# Altium project pdmlse_pcb.PrjPcb (part 2 of 4)

## Sheet LDOs.SchDoc: Power Delivery
size D; Author: Kunmo Kim; DrawnBy: Kunmo Kim; SheetNumber: 2; SheetTotal: 15
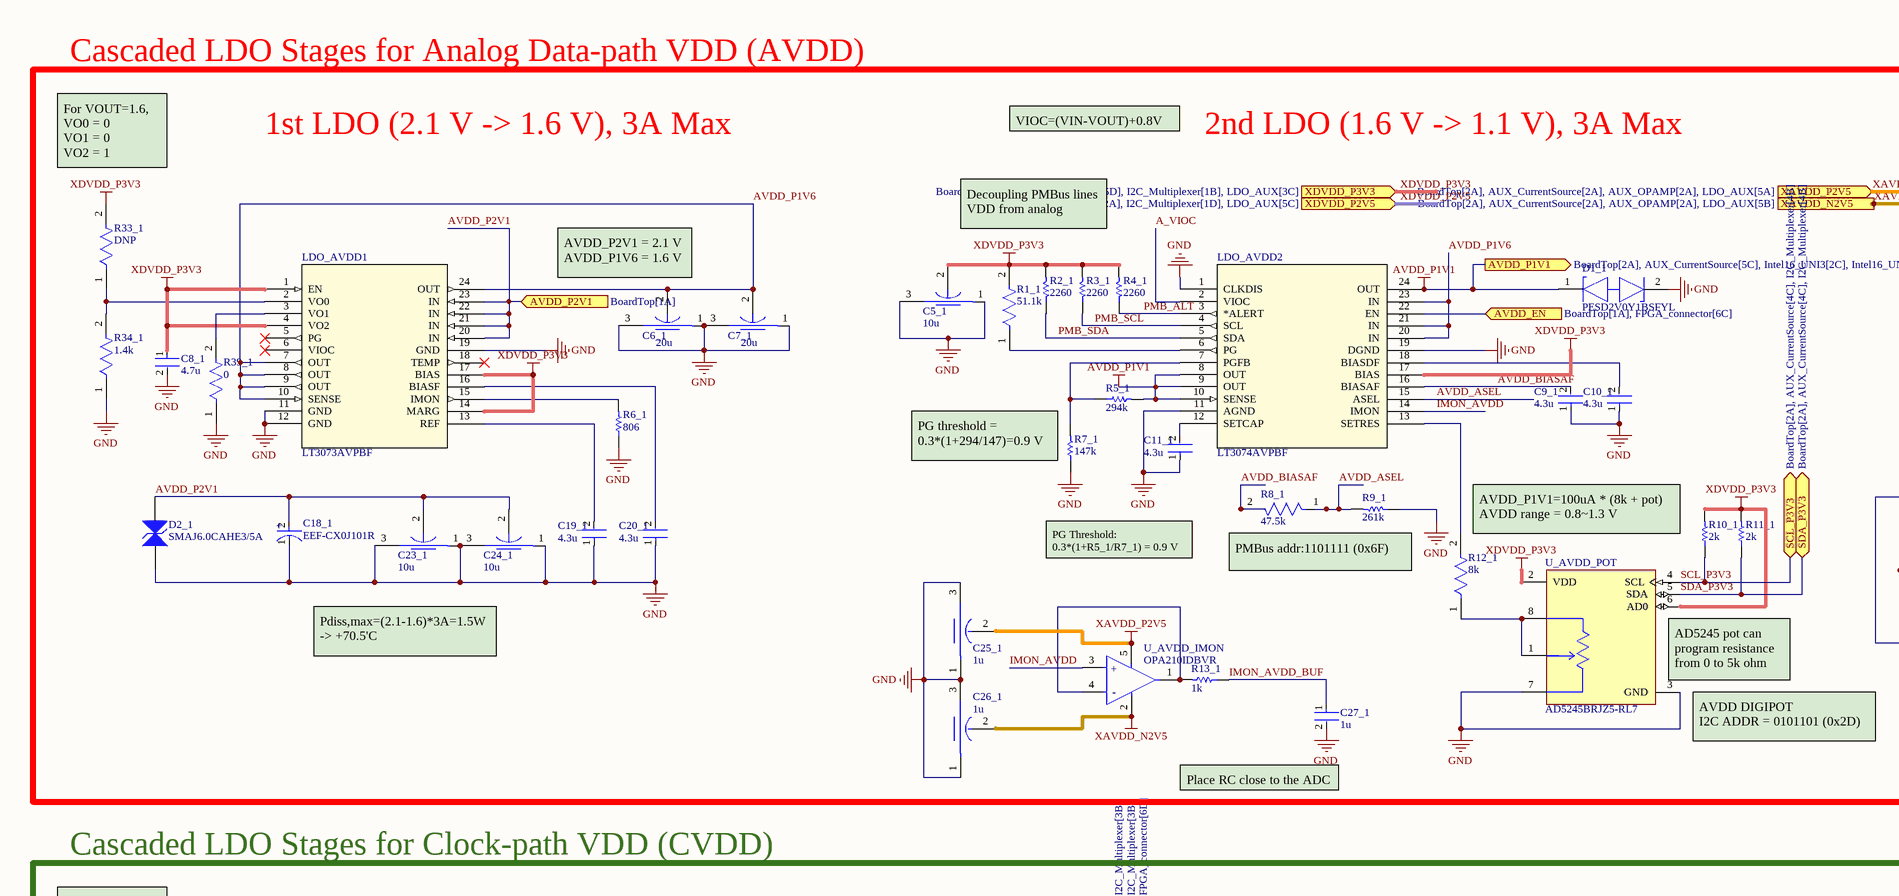
[diagram p1: LDOs.SchDoc, top left]
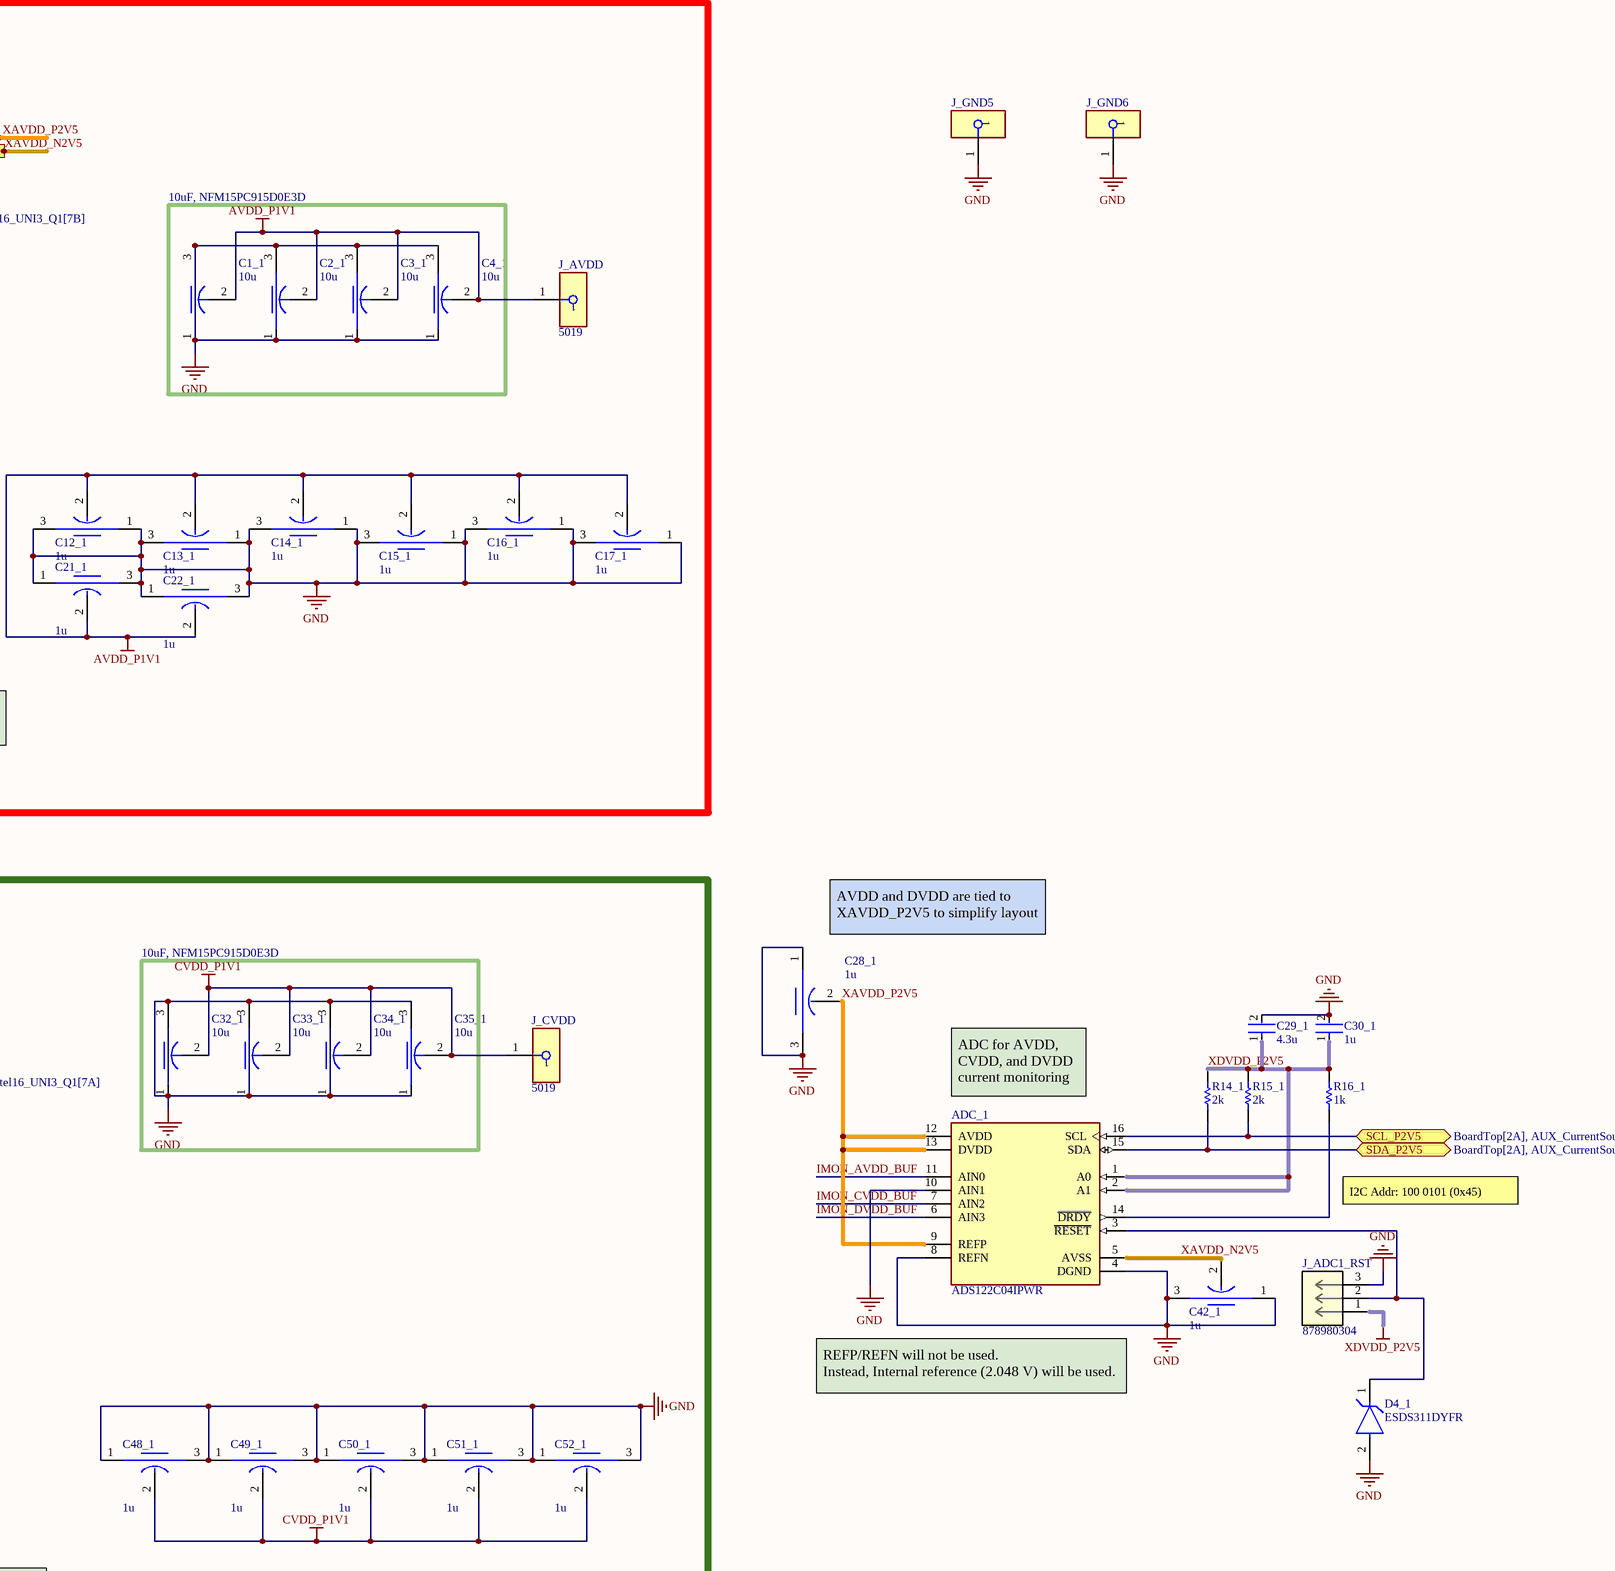
[diagram p2: LDOs.SchDoc, top right]
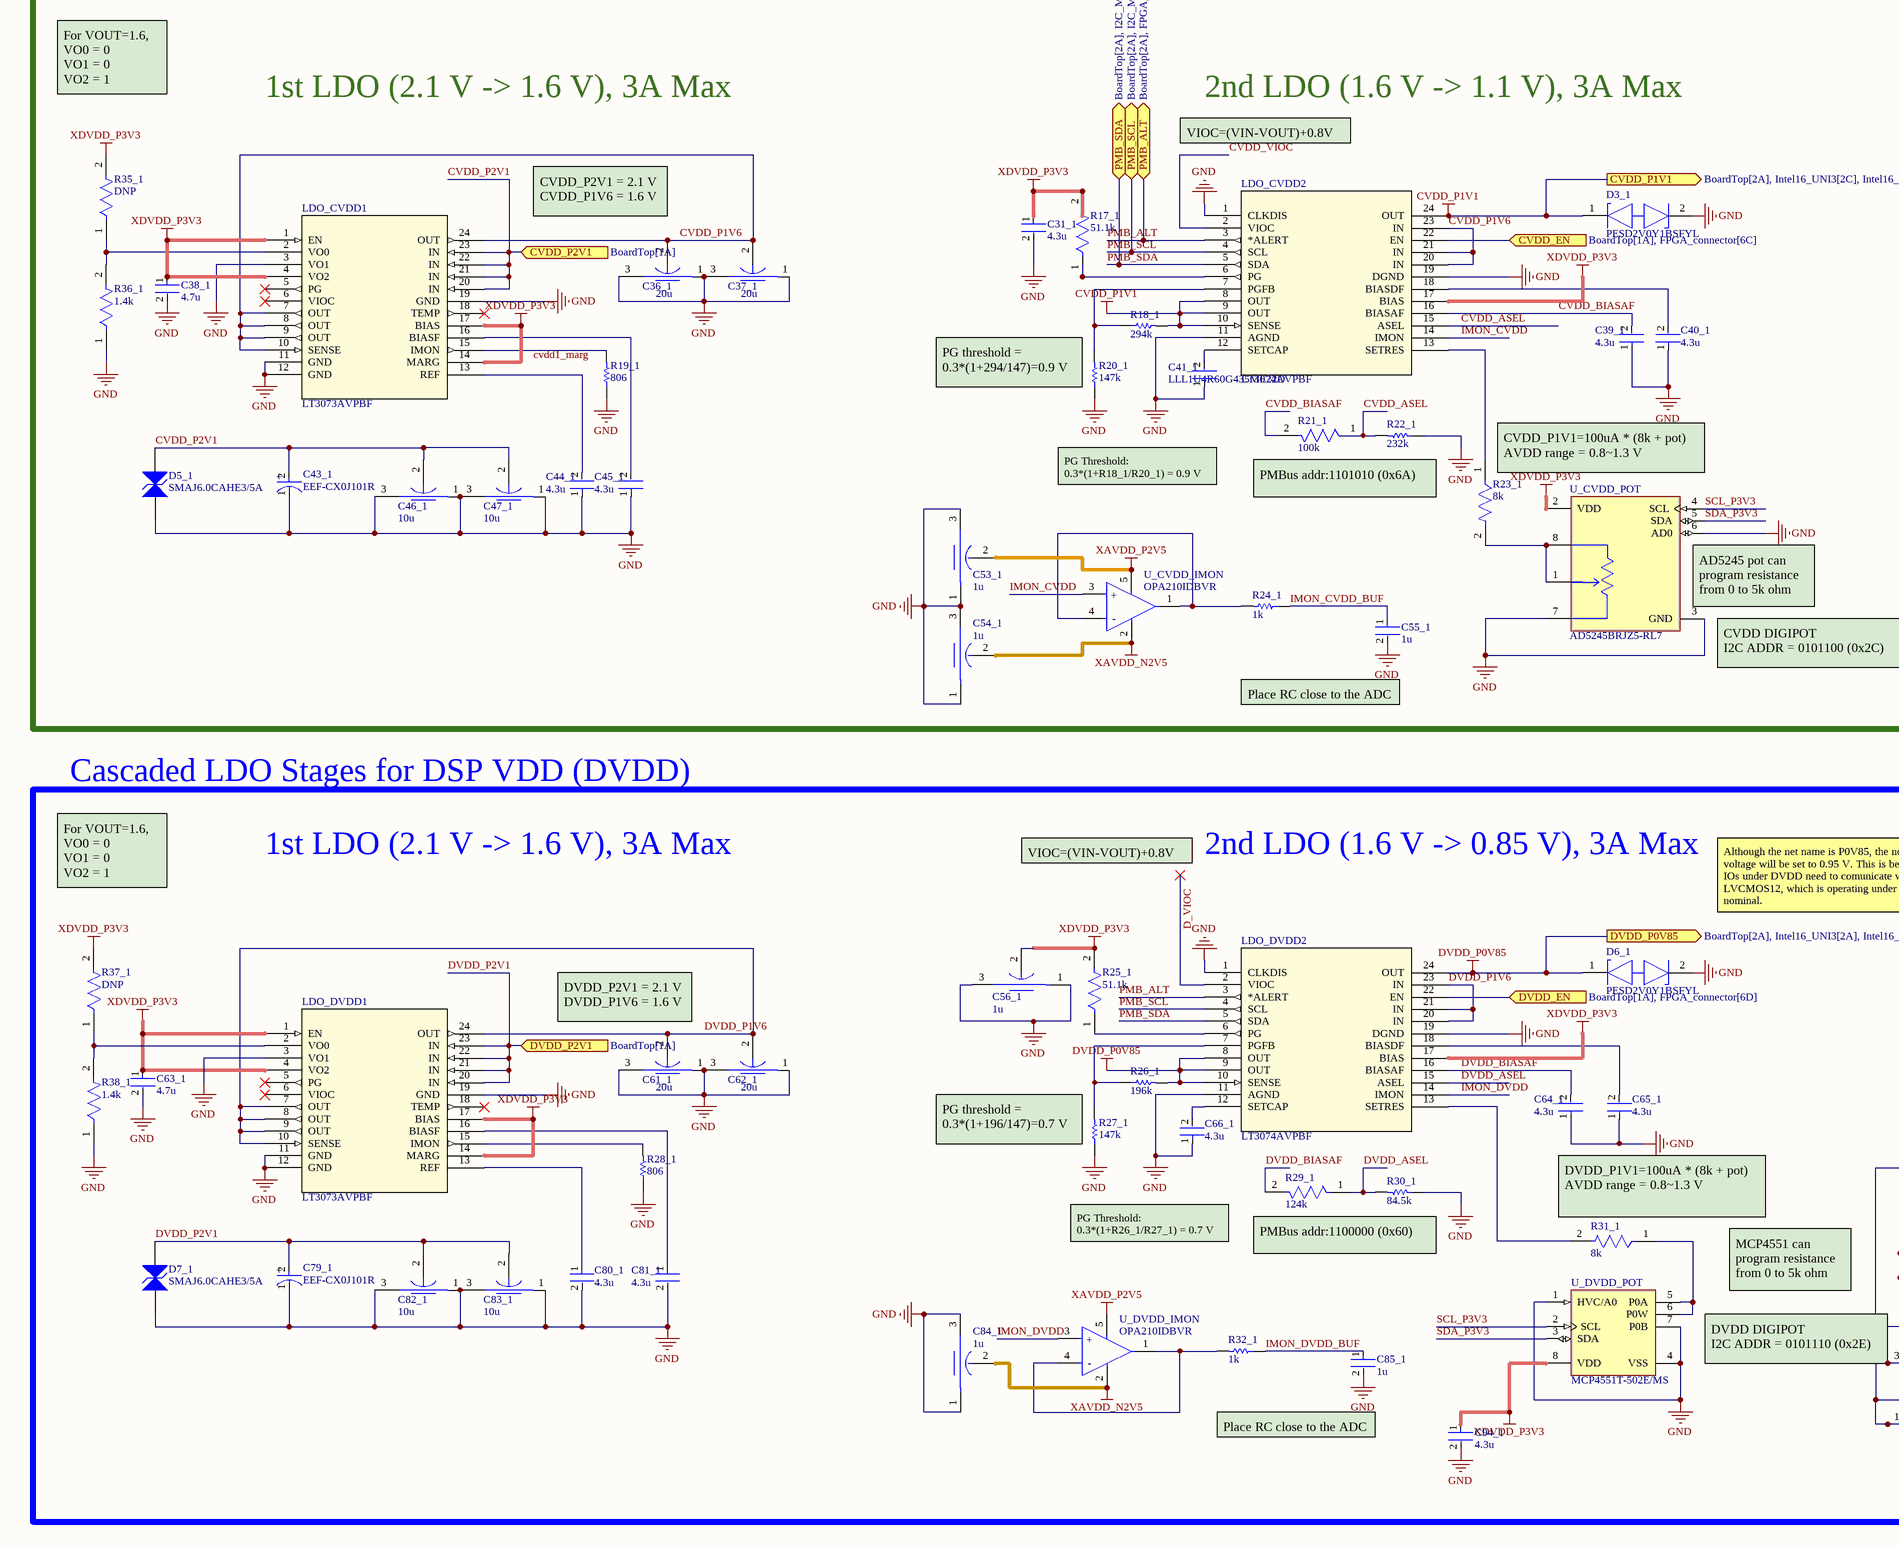
[diagram p3: LDOs.SchDoc, bottom left]
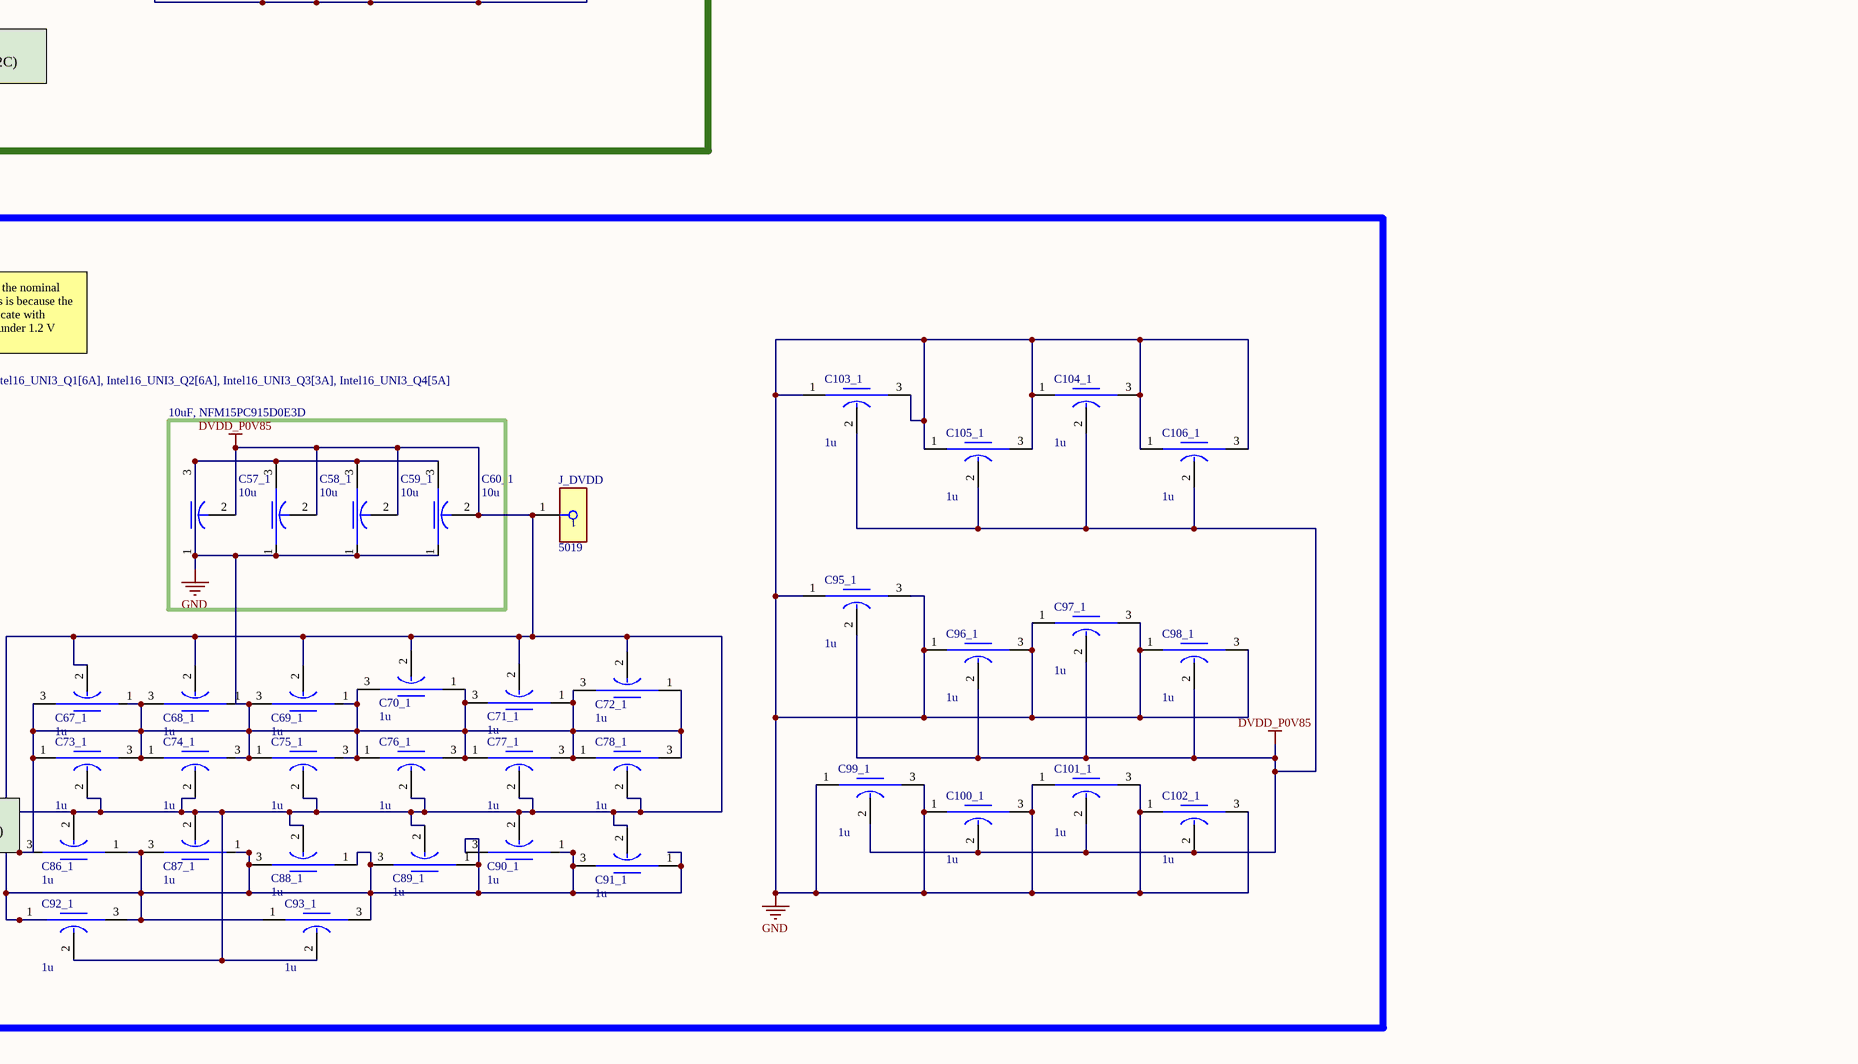
[diagram p4: LDOs.SchDoc, bottom right]

### Parts
ADC_1  ADS122C04IPWR  [FP-PW0016A-IPC_C]
C1_1  10u  [FP-NFM15-0_2-MFG]
C2_1  10u  [FP-NFM15-0_2-MFG]
C3_1  10u  [FP-NFM15-0_2-MFG]
C4_1  10u  [FP-NFM15-0_2-MFG]
C5_1  10u  [FP-NFM15-0_2-MFG]
C6_1  20u  [FP-NFM15-0_2-MFG]
C7_1  20u  [FP-NFM15-0_2-MFG]
C8_1  4.7u  [FP-GRM155-0_1-IPC_B]
C9_1  4.3u  [FP-LLL1U4-0_05-IPC_C]
C10_1  4.3u  [FP-LLL1U4-0_05-IPC_C]
C11_1  4.3u  [FP-LLL1U4-0_05-IPC_C]
C12_1  1u  [PCBComponent_1]
C13_1  1u  [PCBComponent_1]
C14_1  1u  [PCBComponent_1]
C15_1  1u  [PCBComponent_1]
C16_1  1u  [PCBComponent_1]
C17_1  1u  [PCBComponent_1]
C18_1  EEF-CX0J101R  [FP-CX-MFG]
C19_1  4.3u  [FP-LLL1U4-0_05-IPC_C]
C20_1  4.3u  [FP-LLL1U4-0_05-IPC_C]
C21_1  1u  [PCBComponent_1]
C22_1  1u  [PCBComponent_1]
C23_1  10u  [FP-NFM15-0_2-MFG]
C24_1  10u  [FP-NFM15-0_2-MFG]
C25_1  1u  [PCBComponent_1]
C26_1  1u  [PCBComponent_1]
C27_1  1u  [FP-C0402C105K8PACTU-IPC_A]
C28_1  1u  [PCBComponent_1]
C29_1  4.3u  [FP-LLL1U4-0_05-MFG]
C30_1  1u  [FP-C0402C105K8PACTU-IPC_A]
C31_1  4.3u  [FP-LLL1U4-0_05-IPC_C]
C32_1  10u  [FP-NFM15-0_2-MFG]
C33_1  10u  [FP-NFM15-0_2-MFG]
C34_1  10u  [FP-NFM15-0_2-MFG]
C35_1  10u  [FP-NFM15-0_2-MFG]
C36_1  20u  [FP-NFM15-0_2-MFG]
C37_1  20u  [FP-NFM15-0_2-MFG]
C38_1  4.7u  [FP-GRM155-0_1-IPC_B]
C39_1  4.3u  [FP-LLL1U4-0_05-IPC_C]
C40_1  4.3u  [FP-LLL1U4-0_05-IPC_C]
C41_1  LLL1U4R60G435ME22D  [FP-LLL1U4-0_05-IPC_C]
C42_1  1u  [PCBComponent_1]
C43_1  EEF-CX0J101R  [FP-CX-MFG]
C44_1  4.3u  [FP-LLL1U4-0_05-IPC_C]
C45_1  4.3u  [FP-LLL1U4-0_05-IPC_C]
C46_1  10u  [FP-NFM15-0_2-MFG]
C47_1  10u  [FP-NFM15-0_2-MFG]
C48_1  1u  [PCBComponent_1]
C49_1  1u  [PCBComponent_1]
C50_1  1u  [PCBComponent_1]
C51_1  1u  [PCBComponent_1]
C52_1  1u  [PCBComponent_1]
C53_1  1u  [PCBComponent_1]
C54_1  1u  [PCBComponent_1]
C55_1  1u  [FP-C0402C105K8PACTU-IPC_A]
C56_1  1u  [PCBComponent_1]
C57_1  10u  [FP-NFM15-0_2-MFG]
C58_1  10u  [FP-NFM15-0_2-MFG]
C59_1  10u  [FP-NFM15-0_2-MFG]
C60_1  10u  [FP-NFM15-0_2-MFG]
C61_1  20u  [FP-NFM15-0_2-MFG]
C62_1  20u  [FP-NFM15-0_2-MFG]
C63_1  4.7u  [FP-GRM155-0_1-IPC_B]
C64_1  4.3u  [FP-LLL1U4-0_05-IPC_C]
C65_1  4.3u  [FP-LLL1U4-0_05-IPC_C]
C66_1  4.3u  [FP-LLL1U4-0_05-IPC_C]
C67_1  1u  [PCBComponent_1]
C68_1  1u  [PCBComponent_1]
C69_1  1u  [PCBComponent_1]
C70_1  1u  [PCBComponent_1]
C71_1  1u  [PCBComponent_1]
C72_1  1u  [PCBComponent_1]
C73_1  1u  [PCBComponent_1]
C74_1  1u  [PCBComponent_1]
C75_1  1u  [PCBComponent_1]
C76_1  1u  [PCBComponent_1]
C77_1  1u  [PCBComponent_1]
C78_1  1u  [PCBComponent_1]
C79_1  EEF-CX0J101R  [FP-CX-MFG]
C80_1  4.3u  [FP-LLL1U4-0_05-IPC_C]
C81_1  4.3u  [FP-LLL1U4-0_05-IPC_C]
C82_1  10u  [FP-NFM15-0_2-MFG]
C83_1  10u  [FP-NFM15-0_2-MFG]
C84_1  1u  [PCBComponent_1]
C85_1  1u  [FP-C0402C105K8PACTU-IPC_A]
C86_1  1u  [PCBComponent_1]
C87_1  1u  [PCBComponent_1]
C88_1  1u  [PCBComponent_1]
C89_1  1u  [PCBComponent_1]
C90_1  1u  [PCBComponent_1]
C91_1  1u  [PCBComponent_1]
C92_1  1u  [PCBComponent_1]
C93_1  1u  [PCBComponent_1]
C94_1  4.3u  [FP-LLL1U4-0_05-MFG]
C95_1  1u  [PCBComponent_1]
C96_1  1u  [PCBComponent_1]
C97_1  1u  [PCBComponent_1]
C98_1  1u  [PCBComponent_1]
C99_1  1u  [PCBComponent_1]
C100_1  1u  [PCBComponent_1]
C101_1  1u  [PCBComponent_1]
C102_1  1u  [PCBComponent_1]
C103_1  1u  [PCBComponent_1]
C104_1  1u  [PCBComponent_1]
C105_1  1u  [PCBComponent_1]
C106_1  1u  [PCBComponent_1]
D1_1  PESD2V0Y1BSFYL  [FP-SOD962-2-MFG]
D2_1  SMAJ6.0CAHE3/5A  [VISH-DO-214AC-2_L]
D3_1  PESD2V0Y1BSFYL  [FP-SOD962-2-MFG]
D4_1  ESDS311DYFR  [FP-DYF0002A-IPC_B]
D5_1  SMAJ6.0CAHE3/5A  [VISH-DO-214AC-2_L]
D6_1  PESD2V0Y1BSFYL  [FP-SOD962-2-MFG]
D7_1  SMAJ6.0CAHE3/5A  [VISH-DO-214AC-2_L]
J_ADC1_RST  878980304  [CONN03_87898_M-5p84_MOL]
J_AVDD  5019  [FP-5019-MFG]
J_CVDD  5019  [FP-5019-MFG]
J_DVDD  5019  [FP-5019-MFG]
J_GND5  5019  [FP-5019-MFG]  (value not drawn)
J_GND6  5019  [FP-5019-MFG]  (value not drawn)
LDO_AVDD1  LT3073AVPBF  [05-08-7054_ADI]
LDO_AVDD2  LT3074AVPBF  [LGA_CC-22-4_ADI]
LDO_CVDD1  LT3073AVPBF  [05-08-7054_ADI]
LDO_CVDD2  LT3074AVPBF  [LGA_CC-22-4_ADI]
LDO_DVDD1  LT3073AVPBF  [05-08-7054_ADI]
LDO_DVDD2  LT3074AVPBF  [LGA_CC-22-4_ADI]
R1_1  51.1k  [FP-ERJ3EK-MFG]
R2_1  2260  [RESC1005X40X25NL05T05]
R3_1  2260  [RESC1005X40X25NL05T05]
R4_1  2260  [RESC1005X40X25NL05T05]
R5_1  294k  [RESC1005X40X25ML05T05]
R6_1  806  [RESC1005X40X25ML05T05]
R7_1  147k  [RESC1005X40X25NL05T05]
R8_1  47.5k  [FP-ERJ2RK-MFG]
R9_1  261k  [RESC1005X40X25LL05T05]
R10_1  2k  [RESC1608X55X30ML15T15]
R11_1  2k  [RESC1608X55X30ML15T15]
R12_1  8k  [FP-RT0603-0_55-MFG]
R13_1  1k  [RESC1608X55X30LL15T15]
R14_1  2k  [RESC1608X55X30ML15T15]
R15_1  2k  [RESC1608X55X30ML15T15]
R16_1  1k  [RESC1608X55X30LL15T15]
R17_1  51.1k  [FP-ERJ3EK-MFG]
R18_1  294k  [RESC1005X40X25ML05T05]
R19_1  806  [RESC1005X40X25ML05T05]
R20_1  147k  [RESC1005X40X25NL05T05]
R21_1  100k  [FP-ERJ2RK-MFG]
R22_1  232k  [RESC1005X40X25LL05T05]
R23_1  8k  [FP-RT0603-0_55-MFG]
R24_1  1k  [RESC1608X55X30LL15T15]
R25_1  51.1k  [FP-ERJ3EK-MFG]
R26_1  196k  [RESC1005X40X25NL05T05]
R27_1  147k  [RESC1005X40X25NL05T05]
R28_1  806  [RESC1005X40X25ML05T05]
R29_1  124k  [FP-ERJ2RK-MFG]
R30_1  84.5k  [RESC1005X40X25ML05T05]
R31_1  8k  [FP-RT0603-0_55-MFG]
R32_1  1k  [RESC1608X55X30LL15T15]
R33_1  DNP  [FP-CPF0603-IPC_C]
R34_1  1.4k  [FP-CPF0603-IPC_C]
R35_1  DNP  [FP-CPF0603-IPC_C]
R36_1  1.4k  [FP-CPF0603-IPC_C]
R37_1  DNP  [FP-CPF0603-IPC_C]
R38_1  1.4k  [FP-CPF0603-IPC_C]
R39_1  0  [FP-CRG0603-IPC_A]
U_AVDD_IMON  OPA210IDBVR  [FP-DBV0005A-MFG]
U_AVDD_POT  AD5245BRJZ5-RL7  [FP-RJ-8-IPC_A]
U_CVDD_IMON  OPA210IDBVR  [FP-DBV0005A-MFG]
U_CVDD_POT  AD5245BRJZ5-RL7  [FP-RJ-8-IPC_A]
U_DVDD_IMON  OPA210IDBVR  [FP-DBV0005A-MFG]
U_DVDD_POT  MCP4551T-502E/MS  [MSOP-MS8_L]

### Blocks framed on the sheet
10uF, NFM15PC915D0E3D: C1_1 C2_1 C3_1 C4_1
10uF, NFM15PC915D0E3D: C32_1 C33_1 C34_1 C35_1
10uF, NFM15PC915D0E3D: C57_1 C58_1 C59_1 C60_1

### Ports
AVDD_EN (in, see BoardTop[1A], FPGA_connector[6C]), AVDD_P1V1 (out, see BoardTop[2A], AUX_CurrentSource[5C], Intel16_UNI3[2C], Intel16_UNI3_Q1[7B]), AVDD_P2V1 (in, see BoardTop[1A]), CVDD_EN (in, see BoardTop[1A], FPGA_connector[6C]), CVDD_P1V1 (out, see BoardTop[2A], Intel16_UNI3[2C], Intel16_UNI3_Q1[7A]), CVDD_P2V1 (in, see BoardTop[1A]), DVDD_EN (in, see BoardTop[1A], FPGA_connector[6D]), DVDD_P0V85 (out, see BoardTop[2A], Intel16_UNI3[2A], Intel16_UNI3_Q1[6A], Intel16_UNI3_Q2[6A], Intel16_UNI3_Q3[3A], Intel16_UNI3_Q4[5A]), DVDD_P2V1 (in, see BoardTop[1A]), PMB_ALT (bidir, see BoardTop[2A], FPGA_connector[6D]), PMB_SCL (bidir, see BoardTop[2A], I2C_Multiplexer[3B]), PMB_SDA (bidir, see BoardTop[2A], I2C_Multiplexer[3B]), SCL_P2V5 (bidir, see BoardTop[2A], AUX_CurrentSource[2C], AUX_OPAMP[3B], I2C_Multiplexer[3B]), SCL_P3V3 (bidir, see BoardTop[2A], AUX_CurrentSource[4C], I2C_Multiplexer[4B]), SDA_P2V5 (bidir, see BoardTop[2A], AUX_CurrentSource[2C], AUX_OPAMP[3B], I2C_Multiplexer[3B]), SDA_P3V3 (bidir, see BoardTop[2A], AUX_CurrentSource[4C], I2C_Multiplexer[4B]), XAVDD_N2V5 (in, see BoardTop[2A], AUX_CurrentSource[2A], AUX_OPAMP[2A], LDO_AUX[5B]), XAVDD_P2V5 (in, see BoardTop[2A], AUX_CurrentSource[2A], AUX_OPAMP[2A], LDO_AUX[5A]), XDVDD_P2V5 (in, see BoardTop[2A], AUX_OPAMP[2A], I2C_Multiplexer[1D], LDO_AUX[5C]), XDVDD_P3V3 (in, see BoardTop[2A], AUX_CurrentSource[5D], I2C_Multiplexer[1B], LDO_AUX[3C])

### Nets
AVDD_P1V1: C1_1.2(GND) C2_1.2(GND) C3_1.2(GND) C4_1.2(GND) C12_1.2(GND) C13_1.2(GND) C14_1.2(GND) C15_1.2(GND) C16_1.2(GND) C17_1.2(GND) C21_1.2(GND) C22_1.2(GND) D1_1.1(K1) J_AVDD.1 LDO_AVDD2.8(OUT) LDO_AVDD2.9(OUT) LDO_AVDD2.10(SENSE) LDO_AVDD2.24(OUT) R5_1.2 ; port AVDD_P1V1
CVDD_P1V1: C32_1.2(GND) C33_1.2(GND) C34_1.2(GND) C35_1.2(GND) C48_1.2(GND) C49_1.2(GND) C50_1.2(GND) C51_1.2(GND) C52_1.2(GND) D3_1.1(K1) J_CVDD.1 LDO_CVDD2.8(OUT) LDO_CVDD2.9(OUT) LDO_CVDD2.10(SENSE) LDO_CVDD2.24(OUT) R18_1.2 ; port CVDD_P1V1
DVDD_P0V85: C57_1.2(GND) C58_1.2(GND) C59_1.2(GND) C60_1.2(GND) C67_1.2(GND) C68_1.2(GND) C69_1.2(GND) C70_1.2(GND) C71_1.2(GND) C72_1.2(GND) C73_1.2(GND) C74_1.2(GND) C75_1.2(GND) C76_1.2(GND) C77_1.2(GND) C78_1.2(GND) C86_1.2(GND) C87_1.2(GND) C88_1.2(GND) C89_1.2(GND) C90_1.2(GND) C91_1.2(GND) C92_1.2(GND) C93_1.2(GND) C95_1.2(GND) C96_1.2(GND) C97_1.2(GND) C98_1.2(GND) C99_1.2(GND) C100_1.2(GND) C101_1.2(GND) C102_1.2(GND) C103_1.2(GND) C104_1.2(GND) C105_1.2(GND) C106_1.2(GND) D6_1.1(K1) J_DVDD.1 LDO_DVDD2.8(OUT) LDO_DVDD2.9(OUT) LDO_DVDD2.10(SENSE) LDO_DVDD2.24(OUT) R26_1.2 ; port DVDD_P0V85
GND: ADC_1.4(DGND) ADC_1.8(REFN) ADC_1.10(AIN1) C1_1.1(Input) C1_1.3(Output) C2_1.1(Input) C2_1.3(Output) C3_1.1(Input) C3_1.3(Output) C4_1.1(Input) C4_1.3(Output) C5_1.1(Input) C5_1.3(Output) C6_1.1(Input) C6_1.3(Output) C7_1.1(Input) C7_1.3(Output) C8_1.2 C9_1.1 C10_1.1 C11_1.1 C12_1.1(Input) C12_1.3(Output) C13_1.1(Input) C13_1.3(Output) C14_1.1(Input) C14_1.3(Output) C15_1.1(Input) C15_1.3(Output) C16_1.1(Input) C16_1.3(Output) C17_1.1(Input) C17_1.3(Output) C18_1.1(C) C19_1.1 C20_1.1 C21_1.1(Input) C21_1.3(Output) C22_1.1(Input) C22_1.3(Output) C23_1.1(Input) C23_1.3(Output) C24_1.1(Input) C24_1.3(Output) C25_1.1(Input) C25_1.3(Output) C26_1.1(Input) C26_1.3(Output) C27_1.2 C28_1.1(Input) C28_1.3(Output) C29_1.2 C30_1.2 C31_1.2 C32_1.1(Input) C32_1.3(Output) C33_1.1(Input) C33_1.3(Output) C34_1.1(Input) C34_1.3(Output) C35_1.1(Input) C35_1.3(Output) C36_1.1(Input) C36_1.3(Output) C37_1.1(Input) C37_1.3(Output) C38_1.2 C39_1.1 C40_1.1 C41_1.1 C42_1.1(Input) C42_1.3(Output) C43_1.1(C) C44_1.1 C45_1.1 C46_1.1(Input) C46_1.3(Output) C47_1.1(Input) C47_1.3(Output) C48_1.1(Input) C48_1.3(Output) C49_1.1(Input) C49_1.3(Output) C50_1.1(Input) C50_1.3(Output) C51_1.1(Input) C51_1.3(Output) C52_1.1(Input) C52_1.3(Output) C53_1.1(Input) C53_1.3(Output) C54_1.1(Input) C54_1.3(Output) C55_1.2 C56_1.1(Input) C56_1.3(Output) C57_1.1(Input) C57_1.3(Output) C58_1.1(Input) C58_1.3(Output) C59_1.1(Input) C59_1.3(Output) C60_1.1(Input) C60_1.3(Output) C61_1.1(Input) C61_1.3(Output) C62_1.1(Input) C62_1.3(Output) C63_1.2 C64_1.1 C65_1.1 C66_1.1 C67_1.1(Input) C67_1.3(Output) C68_1.1(Input) C68_1.3(Output) C69_1.1(Input) C69_1.3(Output) C70_1.1(Input) C70_1.3(Output) C71_1.1(Input) C71_1.3(Output) C72_1.1(Input) C72_1.3(Output) C73_1.1(Input) C73_1.3(Output) C74_1.1(Input) C74_1.3(Output) C75_1.1(Input) C75_1.3(Output) C76_1.1(Input) C76_1.3(Output) C77_1.1(Input) C77_1.3(Output) C78_1.1(Input) C78_1.3(Output) C79_1.1(C) C80_1.2 C81_1.2 C82_1.1(Input) C82_1.3(Output) C83_1.1(Input) C83_1.3(Output) C84_1.1(Input) C84_1.3(Output) C85_1.2 C86_1.1(Input) C86_1.3(Output) C87_1.1(Input) C87_1.3(Output) C88_1.1(Input) C88_1.3(Output) C89_1.1(Input) C89_1.3(Output) C90_1.1(Input) C90_1.3(Output) C91_1.1(Input) C91_1.3(Output) C92_1.1(Input) C92_1.3(Output) C93_1.1(Input) C93_1.3(Output) C94_1.2 C95_1.1(Input) C95_1.3(Output) C96_1.1(Input) C96_1.3(Output) C97_1.1(Input) C97_1.3(Output) C98_1.1(Input) C98_1.3(Output) C99_1.1(Input) C99_1.3(Output) C100_1.1(Input) C100_1.3(Output) C101_1.1(Input) C101_1.3(Output) C102_1.1(Input) C102_1.3(Output) C103_1.1(Input) C103_1.3(Output) C104_1.1(Input) C104_1.3(Output) C105_1.1(Input) C105_1.3(Output) C106_1.1(Input) C106_1.3(Output) D1_1.2(K2) D2_1.2(A2) D3_1.2(K2) D4_1.2(GND) D5_1.2(A2) D6_1.2(K2) D7_1.2(A2) J_ADC1_RST.3 J_GND5.1 J_GND6.1 LDO_AVDD1.11(GND) LDO_AVDD1.12(GND) LDO_AVDD1.19(GND) LDO_AVDD2.1(CLKDIS) LDO_AVDD2.11(AGND) LDO_AVDD2.19(DGND) LDO_CVDD1.3(VO1) LDO_CVDD1.11(GND) LDO_CVDD1.12(GND) LDO_CVDD1.19(GND) LDO_CVDD2.1(CLKDIS) LDO_CVDD2.11(AGND) LDO_CVDD2.19(DGND) LDO_DVDD1.3(VO1) LDO_DVDD1.11(GND) LDO_DVDD1.12(GND) LDO_DVDD1.19(GND) LDO_DVDD2.1(CLKDIS) LDO_DVDD2.11(AGND) LDO_DVDD2.19(DGND) R6_1.1 R7_1.1 R9_1.1 R19_1.1 R20_1.1 R22_1.1 R27_1.1 R28_1.1 R30_1.1 R34_1.1 R36_1.1 R38_1.1 R39_1.1 U_AVDD_POT.3(GND) U_AVDD_POT.7(B) U_CVDD_POT.3(GND) U_CVDD_POT.6(AD0) U_CVDD_POT.7(B) U_DVDD_POT.1(HVC/A0) U_DVDD_POT.4(VSS) U_DVDD_POT.7(P0B)
XAVDD_N2V5: ADC_1.5(AVSS) C26_1.2(GND) C42_1.2(GND) C54_1.2(GND) C84_1.2(GND) U_AVDD_IMON.2(V-) U_CVDD_IMON.2(V-) U_DVDD_IMON.2(V-) ; port XAVDD_N2V5
XAVDD_P2V5: ADC_1.9(REFP) ADC_1.12(AVDD) ADC_1.13(DVDD) C25_1.2(GND) C28_1.2(GND) C53_1.2(GND) U_AVDD_IMON.5(V+) U_CVDD_IMON.5(V+) U_DVDD_IMON.5(V+) ; port XAVDD_P2V5
XDVDD_P2V5: ADC_1.1(A0) ADC_1.2(A1) C29_1.1 C30_1.1 J_ADC1_RST.1 R14_1.2 R15_1.2 R16_1.2 ; port XDVDD_P2V5
XDVDD_P3V3: C5_1.2(GND) C8_1.1 C31_1.1 C38_1.1 C56_1.2(GND) C63_1.1 C94_1.1 LDO_AVDD1.1(EN) LDO_AVDD1.4(VO2) LDO_AVDD1.14(MARG) LDO_AVDD1.17(BIAS) LDO_AVDD2.17(BIAS) LDO_CVDD1.1(EN) LDO_CVDD1.4(VO2) LDO_CVDD1.14(MARG) LDO_CVDD1.17(BIAS) LDO_CVDD2.17(BIAS) LDO_DVDD1.1(EN) LDO_DVDD1.4(VO2) LDO_DVDD1.14(MARG) LDO_DVDD1.17(BIAS) LDO_DVDD2.17(BIAS) R1_1.2 R2_1.2 R3_1.2 R4_1.2 R10_1.2 R11_1.2 R17_1.2 R25_1.2 R33_1.2 R35_1.2 R37_1.2 U_AVDD_POT.2(VDD) U_AVDD_POT.6(AD0) U_CVDD_POT.2(VDD) U_DVDD_POT.8(VDD) ; port XDVDD_P3V3
A_VIOC: LDO_AVDD2.2(VIOC)
AVDD_ASEL: LDO_AVDD2.15(ASEL) R8_1.1 R9_1.2
AVDD_BIASAF: C9_1.2 LDO_AVDD2.16(BIASAF) R8_1.2
AVDD_EN: LDO_AVDD2.22(EN) ; port AVDD_EN
AVDD_P1V6: C6_1.2(GND) C7_1.2(GND) LDO_AVDD1.7(OUT) LDO_AVDD1.8(OUT) LDO_AVDD1.9(OUT) LDO_AVDD1.10(SENSE) LDO_AVDD1.24(OUT) LDO_AVDD2.20(IN) LDO_AVDD2.21(IN) LDO_AVDD2.23(IN)
AVDD_P2V1: C18_1.2(A) C23_1.2(GND) C24_1.2(GND) D2_1.1(A1) LDO_AVDD1.20(IN) LDO_AVDD1.21(IN) LDO_AVDD1.22(IN) LDO_AVDD1.23(IN) ; port AVDD_P2V1
CVDD_ASEL: LDO_CVDD2.15(ASEL) R21_1.1 R22_1.2
CVDD_BIASAF: C39_1.2 LDO_CVDD2.16(BIASAF) R21_1.2
CVDD_EN: LDO_CVDD2.22(EN) ; port CVDD_EN
CVDD_P1V6: C36_1.2(GND) C37_1.2(GND) LDO_CVDD1.7(OUT) LDO_CVDD1.8(OUT) LDO_CVDD1.9(OUT) LDO_CVDD1.10(SENSE) LDO_CVDD1.24(OUT) LDO_CVDD2.20(IN) LDO_CVDD2.21(IN) LDO_CVDD2.23(IN)
CVDD_P2V1: C43_1.2(A) C46_1.2(GND) C47_1.2(GND) D5_1.1(A1) LDO_CVDD1.20(IN) LDO_CVDD1.21(IN) LDO_CVDD1.22(IN) LDO_CVDD1.23(IN) ; port CVDD_P2V1
CVDD_VIOC: LDO_CVDD2.2(VIOC)
D_VIOC: LDO_DVDD2.2(VIOC)
DVDD_ASEL: LDO_DVDD2.15(ASEL) R29_1.1 R30_1.2
DVDD_BIASAF: C64_1.2 LDO_DVDD2.16(BIASAF) R29_1.2
DVDD_EN: LDO_DVDD2.22(EN) ; port DVDD_EN
DVDD_P1V6: C61_1.2(GND) C62_1.2(GND) LDO_DVDD1.7(OUT) LDO_DVDD1.8(OUT) LDO_DVDD1.9(OUT) LDO_DVDD1.10(SENSE) LDO_DVDD1.24(OUT) LDO_DVDD2.20(IN) LDO_DVDD2.21(IN) LDO_DVDD2.23(IN)
DVDD_P2V1: C79_1.2(A) C82_1.2(GND) C83_1.2(GND) D7_1.1(A1) LDO_DVDD1.20(IN) LDO_DVDD1.21(IN) LDO_DVDD1.22(IN) LDO_DVDD1.23(IN) ; port DVDD_P2V1
IMON_AVDD: LDO_AVDD2.14(IMON) U_AVDD_IMON.3(+IN)
IMON_AVDD_BUF: ADC_1.11(AIN0) C27_1.1 R13_1.1
IMON_CVDD: LDO_CVDD2.14(IMON) U_CVDD_IMON.3(+IN)
IMON_CVDD_BUF: ADC_1.7(AIN2) C55_1.1 R24_1.1
IMON_DVDD: LDO_DVDD2.14(IMON) U_DVDD_IMON.3(+IN)
IMON_DVDD_BUF: ADC_1.6(AIN3) C85_1.1 R32_1.1
PMB_ALT: LDO_AVDD2.3(*ALERT) LDO_CVDD2.3(*ALERT) LDO_DVDD2.3(*ALERT) R4_1.1 ; port PMB_ALT
PMB_SCL: LDO_AVDD2.4(SCL) LDO_CVDD2.4(SCL) LDO_DVDD2.4(SCL) R3_1.1 ; port PMB_SCL
PMB_SDA: LDO_AVDD2.5(SDA) LDO_CVDD2.5(SDA) LDO_DVDD2.5(SDA) R2_1.1 ; port PMB_SDA
SCL_P2V5: ADC_1.16(SCL) R15_1.1 ; port SCL_P2V5
SCL_P3V3: R10_1.1 U_AVDD_POT.4(SCL) U_CVDD_POT.4(SCL) U_DVDD_POT.2(SCL) ; port SCL_P3V3
SDA_P2V5: ADC_1.15(SDA) R14_1.1 ; port SDA_P2V5
SDA_P3V3: R11_1.1 U_AVDD_POT.5(SDA) U_CVDD_POT.5(SDA) U_DVDD_POT.3(SDA) ; port SDA_P3V3
NetADC_1_3: ADC_1.3(~{RESET}) D4_1.1(I/O) J_ADC1_RST.2
NetADC_1_14: ADC_1.14(~{DRDY}) R16_1.1
NetC10_1_2: C10_1.2 LDO_AVDD2.18(BIASDF)
NetC11_1_2: C11_1.2 LDO_AVDD2.12(SETCAP)
NetC19_1_2: C19_1.2 LDO_AVDD1.13(REF)
NetC20_1_2: C20_1.2 LDO_AVDD1.16(BIASF)
NetC40_1_2: C40_1.2 LDO_CVDD2.18(BIASDF)
NetC41_1_2: C41_1.2 LDO_CVDD2.12(SETCAP)
NetC44_1_2: C44_1.2 LDO_CVDD1.13(REF)
NetC45_1_2: C45_1.2 LDO_CVDD1.16(BIASF)
NetC65_1_2: C65_1.2 LDO_DVDD2.18(BIASDF)
NetC66_1_2: C66_1.2 LDO_DVDD2.12(SETCAP)
NetC80_1_1: C80_1.1 LDO_DVDD1.13(REF)
NetC81_1_1: C81_1.1 LDO_DVDD1.16(BIASF)
NetLDO_AVDD1_2: LDO_AVDD1.2(VO0) R33_1.1 R34_1.2
NetLDO_AVDD1_3: LDO_AVDD1.3(VO1) R39_1.2
NetLDO_AVDD1_15: LDO_AVDD1.15(IMON) R6_1.2
NetLDO_AVDD2_6: LDO_AVDD2.6(PG) R1_1.1
NetLDO_AVDD2_7: LDO_AVDD2.7(PGFB) R5_1.1 R7_1.2
NetLDO_AVDD2_13: LDO_AVDD2.13(SETRES) R12_1.2
NetLDO_CVDD1_2: LDO_CVDD1.2(VO0) R35_1.1 R36_1.2
NetLDO_CVDD1_15: LDO_CVDD1.15(IMON) R19_1.2
NetLDO_CVDD2_6: LDO_CVDD2.6(PG) R17_1.1
NetLDO_CVDD2_7: LDO_CVDD2.7(PGFB) R18_1.1 R20_1.2
NetLDO_CVDD2_13: LDO_CVDD2.13(SETRES) R23_1.1
NetLDO_DVDD1_2: LDO_DVDD1.2(VO0) R37_1.1 R38_1.2
NetLDO_DVDD1_15: LDO_DVDD1.15(IMON) R28_1.2
NetLDO_DVDD2_6: LDO_DVDD2.6(PG) R25_1.1
NetLDO_DVDD2_7: LDO_DVDD2.7(PGFB) R26_1.1 R27_1.2
NetLDO_DVDD2_13: LDO_DVDD2.13(SETRES) R31_1.2
NetR12_1_1: R12_1.1 U_AVDD_POT.1(W) U_AVDD_POT.8(A)
NetR13_1_2: R13_1.2 U_AVDD_IMON.1(OUT) U_AVDD_IMON.4(-IN)
NetR23_1_2: R23_1.2 U_CVDD_POT.1(W) U_CVDD_POT.8(A)
NetR24_1_2: R24_1.2 U_CVDD_IMON.1(OUT) U_CVDD_IMON.4(-IN)
NetR31_1_1: R31_1.1 U_DVDD_POT.5(P0A) U_DVDD_POT.6(P0W)
NetR32_1_2: R32_1.2 U_DVDD_IMON.1(OUT) U_DVDD_IMON.4(-IN)

Not connected (* = marked no-connect by the designer): LDO_AVDD1 5(PG)* 6(VIOC)* 18(TEMP)*; LDO_CVDD1 5(PG)* 6(VIOC)* 18(TEMP)*; LDO_DVDD1 5(PG)* 6(VIOC)* 18(TEMP)*

### Notes on the sheet
- Cascaded LDO Stages for Analog Data-path VDD (AVDD)
- 1st LDO (2.1 V -> 1.6 V), 3A Max
- VIOC=(VIN-VOUT)+0.8V
- 2nd LDO (1.6 V -> 1.1 V), 3A Max
- For VOUT=1.6,
  VO0 = 0
  VO1 = 0
  VO2 = 1
- Decoupling PMBus lines VDD from analog
- AVDD_P2V1 = 2.1 V
  AVDD_P1V6 = 1.6 V
- (near R7_1) PG threshold = 0.3*(1+294/147)=0.9 V
- PG Threshold:
  0.3*(1+R5_1/R7_1) = 0.9 V
- PMBus addr:1101111 (0x6F)
- AVDD_P1V1=100uA * (8k + pot)
  AVDD range = 0.8~1.3 V
- Pdiss,max=(2.1-1.6)*3A=1.5W
  -> +70.5'C
- (near U_AVDD_POT) AD5245 pot can
  program resistance
  from 0 to 5k ohm
- (near U_AVDD_POT) AVDD DIGIPOT
  I2C ADDR = 0101101 (0x2D)
- (near C27_1) Place RC close to the ADC
- Cascaded LDO Stages for Clock-path VDD (CVDD)
- (near C28_1) AVDD and DVDD are tied to XAVDD_P2V5 to simplify layout
- (near ADC_1) ADC for AVDD, CVDD, and DVDD current monitoring
- CVDD_P2V1 = 2.1 V
  CVDD_P1V6 = 1.6 V
- I2C Addr: 100 0101 (0x45)
- (near R20_1) PG threshold = 0.3*(1+294/147)=0.9 V
- PG Threshold:
  0.3*(1+R18_1/R20_1) = 0.9 V
- PMBus addr:1101010 (0x6A)
- (near R23_1) CVDD_P1V1=100uA * (8k + pot)
  AVDD range = 0.8~1.3 V
- REFP/REFN will not be used.
  Instead, Internal reference (2.048 V) will be used.
- (near U_CVDD_POT) AD5245 pot can
  program resistance
  from 0 to 5k ohm
- (near U_CVDD_POT) CVDD DIGIPOT
  I2C ADDR = 0101100 (0x2C)
- (near C55_1) Place RC close to the ADC
- Cascaded LDO Stages for DSP VDD (DVDD)
- 2nd LDO (1.6 V -> 0.85 V), 3A Max
- Although the net name is P0V85, the nominal voltage will be set to 0.95 V. This is because the IOs under DVDD need to comunicate with LVCMOS12, which is operating under 1.2 V nominal.
- DVDD_P2V1 = 2.1 V
  DVDD_P1V6 = 1.6 V
- (near R27_1) PG threshold = 0.3*(1+196/147)=0.7 V
- (near R31_1) DVDD_P1V1=100uA * (8k + pot)
  AVDD range = 0.8~1.3 V
- PG Threshold:
  0.3*(1+R26_1/R27_1) = 0.7 V
- PMBus addr:1100000 (0x60)
- MCP4551 can
  program resistance
  from 0 to 5k ohm
- (near C86_1) DVDD DIGIPOT
  I2C ADDR = 0101110 (0x2E)
- Place RC close to the ADC
- Labels drawn without touching a wire or pin: cvdd1_marg
- (in symbol CMP-04895-000347-1) +; -
- (in symbol CMP-05427-000056-1) +

### Library data of the parts
ADC_1 = CMP-04860-000041-1: IC ADC 24BIT SIGMA-DELTA 16TSSOP; Sampling Rate: 2000S/s; Number of Bits: 24; Number of A/D Converters: 1; Number of Inputs: 4; Interface: I2C; Packaging: Tape and Reel; Case/Package: TSSOP; Mount: Surface Mount; RoHS Compliant: Yes; Max Operating Temperature: 125°C; Number of Pins: 16; Min Operating Temperature: -40°C
C1_1 C2_1 C3_1 C4_1 C5_1 C6_1 C7_1 C23_1 C24_1 C32_1 C33_1 C34_1 C35_1 C36_1 C37_1 C46_1 C47_1 C57_1 C58_1 C59_1 C60_1 C61_1 C62_1 C82_1 C83_1 = CMP-06053-000058-1: CAP FEEDTHRU
C8_1 C38_1 C63_1 = CMP-2008-04549-2: Chip Multilayer Ceramic Capacitors for General Purpose, 0402, 4.7uF, X5R, 15%, 20%, 6.3V; Height: 0.5mm; Weight: 0.000212oz; Length: 1mm; Case Code (Metric): 1005; Packaging: Tape and Reel; Termination: SMD/SMT; Dielectric: X5R; Depth: 0.5mm; Case Code (Imperial): 0402; Min Operating Temperature: -55°C; Case/Package: 0402; Voltage: 6.3V; Width: 0.02inch; Capacitance: 4.7uF; Lead Free: Lead Free; Thickness: 0.022inch; Contact Plating: Tin; REACH SVHC: No SVHC; Package Quantity: 10000; Tolerance: 20%; Voltage Rating (DC): 6.3V; Voltage Rating: 6.3V; Mount: Surface Mount; Max Operating Temperature: 85°C
C9_1 C10_1 C11_1 C19_1 C20_1 C29_1 C31_1 C39_1 C40_1 C41_1 C44_1 C45_1 C64_1 C65_1 C66_1 C80_1 C81_1 C94_1 = CMP-06035-061933-1: Cap Ceramic Monolithic 4.3uF 20% 4V X5R 15% 02404 (0610M); Capacitance: 4.3uF; Tolerance: 20%; Voltage Rating: 4V; Min Operating Temperature: -55°C; Case/Package: 0204; Mount: Surface Mount; Max Operating Temperature: 85°C; Packaging: Tape and Reel; RoHS Compliant: Yes
C12_1 C13_1 C14_1 C15_1 C16_1 C17_1 C21_1 C22_1 C25_1 C26_1 C28_1 C42_1 C48_1 C49_1 C50_1 C51_1 C52_1 C53_1 C54_1 C56_1 C67_1 C68_1 C69_1 C70_1 C71_1 C72_1 C73_1 C74_1 C75_1 C76_1 C77_1 C78_1 C84_1 C86_1 C87_1 C88_1 C89_1 C90_1 C91_1 C92_1 C93_1 C95_1 C96_1 C97_1 C98_1 C99_1 C100_1 C101_1 C102_1 C103_1 C104_1 C105_1 C106_1 = CMP-06053-000757-1: 0402(1005M) 4V 1.0UF +/- 20% 3 T; Capacitance: 1uF; Current: 2A; Case/Package: 0402; Max Operating Temperature: 125°C; Min Operating Temperature: -55°C; Mount: Surface Mount; Ratings: AEC-Q200; Series: EMIFIL®, NFM15; Supplier 1: Mouser; Supplier Part Number 1: 81-NFM15HC105D0G3D; Tolerance: 20%; Voltage Rating: 4V
C18_1 C43_1 C79_1 = CMP-05427-000056-1: CAP ALUM POLY 100UF 20% 6.3V SMD; Leakage Current: 63uA; Polarity: Polar; Lead Diameter: 2.4mm; Dissipation Factor: 0.06%; Ripple Current: 2.7A; ESR (Equivalent Series Resistance): 15mR; Life (Hours): 1000Hour; Voltage Rating: 6.3V; Case/Package: 2917; Lead Pitch: 1.3mm; Series: SP-Cap CX; Weight: 0.004586oz; Radiation Hardening: No; Case Code (Imperial): 2917; Length: 7.3mm; Number of Pins: 2; Lead Free: Lead Free; REACH SVHC: No SVHC; Max Operating Temperature: 105°C; Package Quantity: 3500; Packaging: Tape and Reel; Height - Seated (Max): 0.075inch; Mount: Surface Mount; Height: 1.9mm; Termination: SMD/SMT; Voltage: 6.3V; Construction: Flat; Width: 0.169inch; Ripple Current (AC): 2.7A; Capacitance: 100uF; Voltage Rating (DC): 6.3V; Case Code (Metric): 7343; Min Operating Temperature: -40°C; Tolerance: 20%; RoHS Compliant: Yes; Depth: 4.3mm
  C18_1 C79_1: ClassName: InputPowerComponent
C27_1 C30_1 C55_1 C85_1 = CMP-2008-02081-2: CAP CER 1UF 10V X5R 0402; Dielectric Material: Ceramic; Dissipation Factor: 5%; Tolerance: 10%; Number of Pins: 2; Contact Plating: Tin; Min Operating Temperature: -55°C; Termination: SMD/SMT; Lead Free: Lead Free; Construction: Flat; Voltage Rating (DC): 10V; Mount: Surface Mount; Series: C; Thickness: 0.022inch; Width: 0.5mm; Radiation Hardening: No; Capacitance: 1uF; Dielectric: X5R; Height: 0.5mm; Voltage: 10V; Length: 1mm; Depth: 0.5mm; Max Operating Temperature: 85°C; Package Quantity: 1; Packaging: Tape and Reel; RoHS Compliant: Yes; Case Code (Imperial): 0402; Case Code (Metric): 1005; REACH SVHC: No SVHC; Voltage Rating: 10V; Case/Package: 0402; Supplier 1: Mouser; Supplier Part Number 1: 80-C0402C105K8P
D1_1 D3_1 D6_1 = CMP-14436-000022-1: TVS DIODE 2VWM 3VC DSN0603-2
D2_1 D5_1 D7_1 = CMP-0548-00108-2: Transient Voltage Suppressor, 6.40 to 231 V, 6 V Stand-off Voltage, Bi-Directional, -55 to 155 degC, 2-pin DO-214AC, Pb-Free, Tape and Reel; Manufacturer: Vishay Semiconductor; VBR Bi-Directional (V): 6.4 to 231; VWM (V): 6; IFSM: 40 A; ID (uA): 1600; PPPM (W): 400, 300; PackageDescription: 2-Pin DO-214AC (SMA), Body 4.245 x 2.665 mm; Packing: Tape and Reel; RoHS: TRUE; ComponentLink3Description: Package Specification; ComponentLink2Description: Datasheet; Mounting Technology: Surface Mount; Operating Junction and Storage Temperature Range: -55 to 150 degC; ComponentLink2URL: http://www.vishay.com/docs/88390/smaj50a.pdf; ComponentLink1Description: Manufacturer URL; DatasheetVersion: 12/8/2013; PackageReference: DO-214AC-2; ComponentLink3URL: http://www.vishay.com/docs/88390/smaj50a.pdf; PartNumber: SMAJ6.0CAHE3/5A; ComponentLink1URL: http://www.vishay.com/; Supplier 1: Mouser; Supplier Part Number 1: 78-SMAJ6.0CAHE3_A/H; ClassName: InputPowerComponent
D4_1 = CMP-00370-147271020-1: ESDS311DYFR One-channel unidirectional device for 3.3V surge protection in SOD-323 package 2-SOT -40 to 125; Manufacturer Lifecycle Status: ACTIVE; Number of Pins: 2; Width: 1.7mm; Length: 1.3mm; NexarPartId: 147271020; Height: 0m; Case/Package: SOT; Thickness: 850µm; Lifecycle Status: Production
J_ADC1_RST = 878980304: No Description Available; Mfr_Name: Molex Connector Corporation; RefDes: RefDes; Type: Type
J_AVDD J_CVDD J_DVDD J_GND5 J_GND6 = CMP-1672-00008-2: NexarPartId: 22052288; Number of Contacts: 1; Contact Material: Bronze, Silver; Number of Pins: 1; Lead Free: Lead Free; Packaging: Tape and Reel; Mount: Surface Mount; Height: 2.286mm; Contact Plating: Silver; Material: Bronze; Termination: SMD/SMT; REACH SVHC: No SVHC; RoHS: Compliant
LDO_AVDD1 LDO_CVDD1 LDO_DVDD1 = LT3073AVPBF: No Description Available; Mfr_Name: Analog Devices Inc; Type: Power Management; RefDes: RefDes; Supplier 1: Arrow Electronics; Supplier Part Number 1: LT3073AV#PBF
LDO_AVDD2 LDO_CVDD2 LDO_DVDD2 = LT3074AVPBF: No Description Available; Mfr_Name: Analog Devices Inc; RefDes: RefDes; Type: Type; Supplier 1: Mouser; Supplier Part Number 1: 584-LT3074AV#PBF
R1_1 R17_1 R25_1 = CMP-1012-00704-3: NexarPartId: 55421809; Temperature Coefficient: 100ppm/°C; Voltage Rating: 75V; Tolerance: 1%; Voltage Rating (DC): 50V; Max Power Dissipation: 100mW; Resistance: 51.1kΩ; Case Code (Imperial): 0603; Max Operating Temperature: 155°C; Depth: 800µm; Height: 450µm; Lead Free: Lead Free; Features: Automotive AEC-Q200; Military Standard: Not; Contact Plating: Tin; Composition: Thick Film; Case/Package: 0603; Mount: Surface Mount; Width: 787.4µm; Length: 1.6mm; Power Rating: 100mW; Lifecycle Status: Production; Schedule B: 8533210045, 8533210045|8533210045|8533210045|8533210045|8533210045; Radiation Hardening: No; Termination: SMD/SMT; REACH SVHC: Unknown; Case Code (Metric): 1608; RoHS: Compliant; Packaging: Cut Tape (CT); Min Operating Temperature: -55°C; Number of Terminations: 2; Supplier 1: Mouser; Supplier Part Number 1: 667-ERJ-3EKF5112V
R2_1 R3_1 R4_1 = CMP-2002-00782-1: Manufacturer: Panasonic; Part Number: ERJ-2RKF2261X; Supplier 1: Mouser; Supplier Part Number 1: 667-ERJ-2RKF2261X
R5_1 R18_1 = CMP-2002-00845-1: RES SMD 294K OHM 1% 1/10W 0402; Part Number: ERJ-2RKF2943X; Manufacturer: Panasonic
R6_1 R19_1 R28_1 = CMP-2002-01072-1: Manufacturer: Panasonic; Part Number: ERJ-2RKF8060X
R7_1 R20_1 R27_1 = CMP-2002-00688-1: RES SMD 147K OHM 1% 1/10W 0402; Part Number: ERJ-2RKF1473X; Manufacturer: Panasonic
R8_1 = CMP-2002-00957-2: RES SMD 47.5K OHM 1% 1/10W 0402; Voltage Rating: 50V; Max Power Dissipation: 100mW; Temperature Coefficient: 100ppm/°C; Resistance: 47.5kR; Packaging: Tape and Reel; Height: 0.35mm; Resistor Type: Thick Film; Width: 0.02inch; Case Code (Imperial): 0402; Voltage Rating (DC): 50V; Package Quantity: 1; Construction: Rectangular; Termination: SMD/SMT; Min Operating Temperature: -55°C; Case Code (Metric): 1005; Features: Automotive AEC-Q200; Length: 1mm; Number of Terminations: 2; Resistance Tolerance: 1%; Power Rating: 100mW; Size Code: 0402; Contact Plating: Tin; RoHS Compliant: Yes; REACH SVHC: No SVHC; Max Operating Temperature: 155°C; Depth: 0.5mm; Technology: THICK FILM; Tolerance: 1%; Mount: Surface Mount; Series: ERJ; Military Standard: Not; Lead Free: Lead Free; Case/Package: 0402
R9_1 = CMP-2002-00819-1: Manufacturer: Panasonic; Part Number: ERJ-2RKF2613X
R10_1 R11_1 R14_1 R15_1 = CMP-2000-00317-1: Part Number: ERJ-3EKF2001V; Manufacturer: Panasonic
R12_1 R23_1 R31_1 = CMP-00621-71394448-1: RT0603BRE078KL SMD Chip Resistor, 8 kOhm, ± 0.1%, 100 mW, 0603 [1608 Metric], Thin Film, High Precision High Stability; Power Rating: 100mW; Voltage Rating: 75V; Temperature Coefficient: 50ppm/°C; Resistance: 8kΩ; NexarPartId: 71394448; Number of Terminations: 2; Features: Moisture Resistant; Min Operating Temperature: -55°C; Height: 550µm; Case/Package: 0603; Max Operating Temperature: 155°C; Packaging: Tape & Reel; Tolerance: 0.1%; Length: 1.6002mm; Max Power Dissipation: 100mW; RoHS: Compliant; Composition: Thin Film; Width: 787.4µm
R13_1 R16_1 R24_1 R32_1 = CMP-2000-00180-1: Part Number: ERJ-3EKF1001V; Manufacturer: Panasonic; Supplier 1: Mouser; Supplier Part Number 1: 667-ERJ-3EKF1001V
R21_1 = CMP-2002-00608-4: RES SMD 100K OHM 1% 1/10W 0402; Resistance: 100kR; Voltage Rating (DC): 50V; Power Rating: 100mW; Temperature Coefficient: 100ppm/°C; Case/Package: 0402; Length: 1mm; Package Quantity: 1; Radiation Hardening: No; Case Code (Metric): 1005; Contact Plating: Tin; Mount: Surface Mount; Depth: 0.5mm; Max Operating Temperature: 155°C; Lead Free: Lead Free; Width: 0.5mm; Composition: Thick Film; Case Code (Imperial): 0402; Tolerance: 1%; Termination: SMD/SMT; Number of Pins: 2; Height: 0.35mm; Voltage Rating: 50V; Military Standard: Not; REACH SVHC: No SVHC; Packaging: Tape and Reel; Min Operating Temperature: -55°C; Max Power Dissipation: 100mW; Features: Automotive AEC-Q200; Number of Terminations: 2
R22_1 = CMP-2002-00790-1: Manufacturer: Panasonic; Part Number: ERJ-2RKF2323X
R26_1 = CMP-2002-00754-1: RES SMD 196K OHM 1% 1/10W 0402; Manufacturer: Panasonic; Part Number: ERJ-2RKF1963X
R29_1 = CMP-2002-00654-2: NexarPartId: 55403631; Voltage Rating: 50V; Temperature Coefficient: 100ppm/°C; Tolerance: 1%; Power Rating: 100mW; Resistance: 124kΩ; Contact Plating: Tin; REACH SVHC: No SVHC; Depth: 500µm; Military Standard: Not; Width: 508µm; Features: Automotive AEC-Q200; Radiation Hardening: No; RoHS: Compliant; Number of Terminations: 2; Termination: SMD/SMT; Packaging: Cut Tape (CT); Min Operating Temperature: -55°C; Case Code (Metric): 1005; Lifecycle Status: Production; Schedule B: 8533210045, 8533210045; Case/Package: 0402; Length: 1mm; Lead Free: Lead Free; Max Power Dissipation: 100mW; Height: 406.4µm; Mount: Surface Mount; Max Operating Temperature: 155°C; Case Code (Imperial): 0402; Composition: Thick Film; Voltage Rating (DC): 50V
R30_1 = CMP-1011-00728-2: Manufacturer: Panasonic; Part Number: ERJ-2RKF8452X
R33_1 R34_1 R35_1 R36_1 R37_1 R38_1 = CMP-03211-004406-1: RES SMD 1.4KΩ 0.1% 1/16W 0603; Manufacturer Part Number: CPF0603B1K4E1; Manufacturer: TE Connectivity; Temperature Coefficient: 25ppm/°C; Voltage Rating: 50V; Power Rating: 0.063W; Resistance: 1.4KΩ; packaging: 1k Reel; Height: 0.55mm; Composition: Thin Film; Lead Free: Yes; Tolerance: 0.1%; Package: CPF0603; Category: Res; Octopart: https://octopart.com/cpf0603b1k4e1-te+connectivity-22739536; RoHS: TRUE; Ipc Land Pattern Name: RESC15580X45; Value: 1.4KΩ; Temperature Range High: +155°C; Temperature: -55°C to +155°C; ComponentLink2Description: Datasheet; octopart_url: https://octopart.com/cpf0603b1k4e1-te+connectivity-22739536; Temperature Range Low: -55°C; ComponentLink2URL: https://www.te.com/commerce/DocumentDelivery/DDEController?Action=showdoc&DocId=Data+Sheet%7F1773200%7FM%7Fpdf%7FEnglish%7FENG_DS_1773200_M.pdf%7F3-1676481-2; Automotive: No; Device Class L2: Resistors; Device Class L1: Passive Components; Series: CPF; Device Class L3: Chip SMD Resistors
R39_1 = CMP-03211-011415-1: RES SMD 0 OHM JUMPER 1/10W 0603; Voltage Rating: 50V; Resistance: 0mR; Power Rating: 100mW; Number of Resistors: 1; Tolerance: 0%; Temperature Coefficient: 100ppm/°C; Packaging: Tape and Reel; Series: CRG, Neohm; Technology: THICK FILM; Depth: 0.8mm; Width: 0.8mm; Min Operating Temperature: -55°C; Number of Terminations: 2; Length: 1.6mm; Weight: 7.1E-05oz; Resistor Type: Thick Film; Height: 0.45mm; Max Operating Temperature: 125°C; Case/Package: 0603; ELV: Compliant; Package Quantity: 5000; Radiation Hardening: No; RoHS Compliant: Yes; Termination: Solder; Case Code (Metric): 1608; Mount: Surface Mount; Case Code (Imperial): 0603; Max Power Dissipation: 100mW
U_AVDD_IMON U_CVDD_IMON U_DVDD_IMON = CMP-04895-000347-1: 3.3-V, LOW-DRIFT, LOW-POWER, SMA
U_AVDD_POT U_CVDD_POT = CMP-09083-000007-1: IC DGTL POT 5KOHM 256TAP SOT23-8; Manufacturer: Analog Devices Inc; Max Supply Voltage: 5.5V; Max Junction Temp: +150°C; Tolerance: 30%; Number Of Taps: 256; Number Of Circuits: 1; Temperature Coefficient: 45ppm/°C; Nominal Resistance: 5kΩ; Nominal Supply Current: 3uA; Interface: I2C; Min Supply Voltage: 2.7V; Temperature Range High: +125°C; Lead Free: Yes; Mouser Description: Digital Potentiometer 5kOhm 256POS Volatile Automotive 8-Pin SOT-23 T/R; Device Class L1: Integrated Circuits (ICs); Automotive: No; ComponentLink2Description: Datasheet; Category: IC; Package: RJ-8; RoHS: TRUE; ComponentLink2URL: https://www.analog.com/media/en/technical-documentation/data-sheets/AD5245.pdf; Manufacturer Part Number: AD5245BRJZ5-RL7; Ipc Land Pattern Name: SOT65P280X145-8; Device Class L3: Digital Potentiometers; Temperature Range Low: -40°C; Octopart: https://octopart.com/ad5245brjz5-rl7-analog+devices-446720; Digikey Description: IC DGTL POT 5KOHM 256TAP SOT23-8; Temperature: -40°C to +125°C; Device Class L2: Data Converter ICs; Height: 1.45mm
U_DVDD_POT = CMP-0188-00126-2: 8-Bit Single I2C Digital POT with Volatile Memory, 8-pin MSOP, Extended Temperature, Tape and Reel; ComponentLink1Description: Manufacturer URL; ComponentLink2URL: http://ww1.microchip.com/downloads/en/DeviceDoc/DS-22096a.pdf; DatasheetVersion: revA, Nov-2008; PackageDescription: 8-Lead Plastic Micro Small Outline Package (MS) [MSOP]; PackageReference: MSOP-MS8; ComponentLink2Description: Datasheet; ComponentLink3Description: Package Specification; PackageVersion: revBB, Aug-2009; ComponentLink1URL: http://www.microchip.com/; ComponentLink3URL: http://www.microchip.com/stellent/groups/techpub_sg/documents/packagingspec/en012702.pdf; RevisionNote: URLs added.